# Altium project LimeSDR-QPCIe_1v2.PrjPcb (part 11 of 13)

## Sheet 27_BoardPowerSupply 1.SchDoc: Board power supply 1
size A3; Organization: Lime Microsystems; Address1: Surrey Tech Centre; Address2: Guildford GU2 7YG; Address3: Surrey; Address4: United Kingdom; Revision: v1.2; SheetNumber: 25; SheetTotal: 27
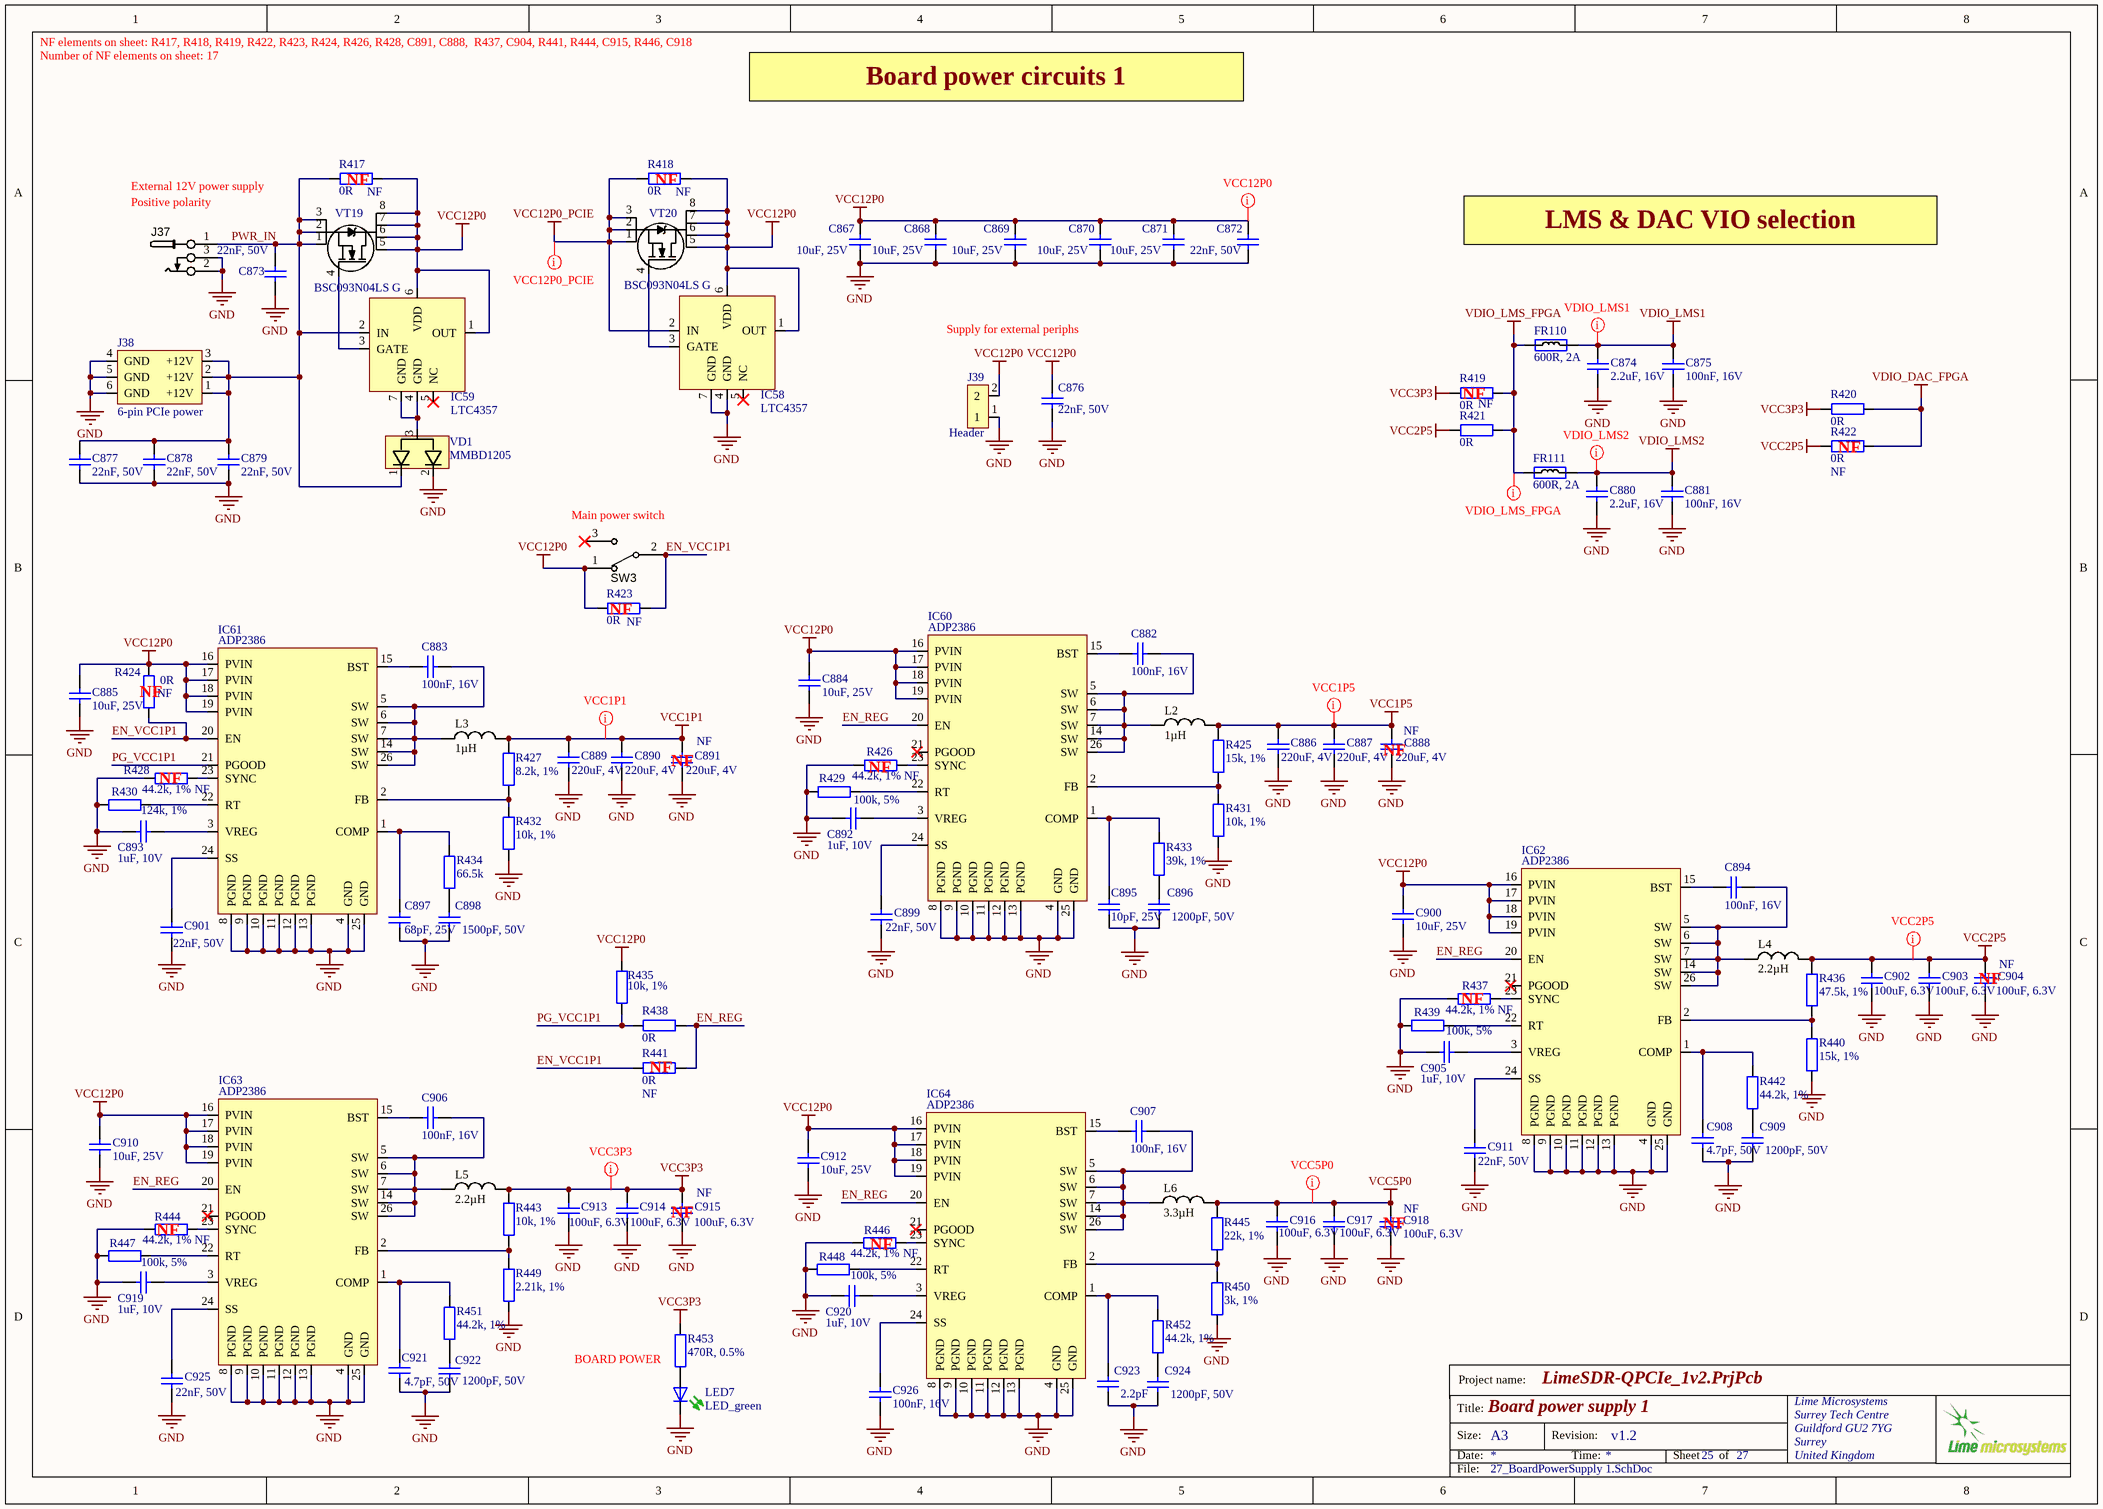
[diagram p26: 27_BoardPowerSupply 1.SchDoc]

### Parts
C867  10uF, 25V  [CAP0603]
C868  10uF, 25V  [CAP0603]
C869  10uF, 25V  [CAP0603]
C870  10uF, 25V  [CAP0603]
C871  10uF, 25V  [CAP0603]
C872  22nF, 50V  [CAP0402]
C873  22nF, 50V  [CAP0402]
C874  2.2uF, 16V  [CAP0402]
C875  100nF, 16V  [CAP0402]
C876  22nF, 50V  [CAP0402]
C877  22nF, 50V  [CAP0402]
C878  22nF, 50V  [CAP0402]
C879  22nF, 50V  [CAP0402]
C880  2.2uF, 16V  [CAP0402]
C881  100nF, 16V  [CAP0402]
C882  100nF, 16V  [CAP0402]
C883  100nF, 16V  [CAP0402]
C884  10uF, 25V  [CAP0805]
C885  10uF, 25V  [CAP0805]
C886  220uF, 4V  [CAP1206]
C887  220uF, 4V  [CAP1206]
C888  220uF, 4V  Assembly Info: NF  [CAP1206]
C889  220uF, 4V  [CAP1206]
C890  220uF, 4V  [CAP1206]
C891  220uF, 4V  Assembly Info: NF  [CAP1206]
C892  1uF, 10V  [CAP0402]
C893  1uF, 10V  [CAP0402]
C894  100nF, 16V  [CAP0402]
C895  10pF, 25V  [CAP0402]
C896  1200pF, 50V  [CAP0402]
C897  68pF, 25V  [CAP0402]
C898  1500pF, 50V  [CAP0402]
C899  22nF, 50V  [CAP0402]
C900  10uF, 25V  [CAP0805]
C901  22nF, 50V  [CAP0402]
C902  100uF, 6.3V  [CAP1206]
C903  100uF, 6.3V  [CAP1206]
C904  100uF, 6.3V  Assembly Info: NF  [CAP1206]
C905  1uF, 10V  [CAP0402]
C906  100nF, 16V  [CAP0402]
C907  100nF, 16V  [CAP0402]
C908  4.7pF, 50V  [CAP0402]
C909  1200pF, 50V  [CAP0402]
C910  10uF, 25V  [CAP0805]
C911  22nF, 50V  [CAP0402]
C912  10uF, 25V  [CAP0805]
C913  100uF, 6.3V  [CAP1206]
C914  100uF, 6.3V  [CAP1206]
C915  100uF, 6.3V  Assembly Info: NF  [CAP1206]
C916  100uF, 6.3V  [CAP1206]
C917  100uF, 6.3V  [CAP1206]
C918  100uF, 6.3V  Assembly Info: NF  [CAP1206]
C919  1uF, 10V  [CAP0402]
C920  1uF, 10V  [CAP0402]
C921  4.7pF, 50V  [CAP0402]
C922  1200pF, 50V  [CAP0402]
C923  2.2pF  [CAP0402]
C924  1200pF, 50V  [CAP0402]
C925  22nF, 50V  [CAP0402]
C926  100nF, 16V  [CAP0402]
FR110  600R, 2A  [RES0805]
FR111  600R, 2A  [RES0805]
IC58  LTC4357  [LTC4357]
IC59  LTC4357  [LTC4357]
IC60  ADP2386  [ADP2386]
IC61  ADP2386  [ADP2386]
IC62  ADP2386  [ADP2386]
IC63  ADP2386  [ADP2386]
IC64  ADP2386  [ADP2386]
J37  CONN_PWR_JACK_2.1x5.5mm  [CONN_PWR_JACK_v2]  (value not drawn)
J38  6-pin PCIe power  [PCIe_POWER_HEADER_6PIN]
J39  Header  [HDR_1x2]
L2  1µH  [FDVE1040_TOKO_INDUCTOR]
L3  1µH  [FDVE1040_TOKO_INDUCTOR]
L4  2.2µH  [FDVE1040_TOKO_INDUCTOR]
L5  2.2µH  [FDVE1040_TOKO_INDUCTOR]
L6  3.3µH  [FDVE1040_TOKO_INDUCTOR]
LED7  LED_green  [LED-0603-GREEN]
R417  0R  Assembly Info: NF  [RES0805]
R418  0R  Assembly Info: NF  [RES0805]
R419  0R  Assembly Info: NF  [RES0402]
R420  0R  [RES0402]
R421  0R  [RES0402]
R422  0R  Assembly Info: NF  [RES0402]
R423  0R  Assembly Info: NF  [RES0402]
R424  0R  Assembly Info: NF  [RES0402]
R425  15k, 1%  [RES0402]
R426  44.2k, 1%  Assembly Info: NF  [RES0402]
R427  8.2k, 1%  [RES0402]
R428  44.2k, 1%  Assembly Info: NF  [RES0402]
R429  100k, 5%  [RES0402]
R430  124k, 1%  [RES0402]
R431  10k, 1%  [RES0402]
R432  10k, 1%  [RES0402]
R433  39k, 1%  [RES0402]
R434  66.5k  [RES0402]
R435  10k, 1%  [RES0402]
R436  47.5k, 1%  [RES0402]
R437  44.2k, 1%  Assembly Info: NF  [RES0402]
R438  0R  [RES0402]
R439  100k, 5%  [RES0402]
R440  15k, 1%  [RES0402]
R441  0R  Assembly Info: NF  [RES0402]
R442  44.2k, 1%  [RES0402]
R443  10k, 1%  [RES0402]
R444  44.2k, 1%  Assembly Info: NF  [RES0402]
R445  22k, 1%  [RES0402]
R446  44.2k, 1%  Assembly Info: NF  [RES0402]
R447  100k, 5%  [RES0402]
R448  100k, 5%  [RES0402]
R449  2.21k, 1%  [RES0402]
R450  3k, 1%  [RES0402]
R451  44.2k, 1%  [RES0402]
R452  44.2k, 1%  [RES0402]
R453  470R, 0.5%  [RES0402]
SW3  ON-ON  [SWITCH_SPDT_SLIDER_v2]  (value not drawn)
VD1  MMBD1205  [SOT23-3_v2]
VT19  BSC093N04LS G  [BSC093N04LS_G]
VT20  BSC093N04LS G  [BSC093N04LS_G]

### Nets
GND: C867.1 C868.1 C869.1 C870.1 C871.1 C872.2 C873.2 C874.1 C875.2 C876.2 C877.2 C878.2 C879.2 C880.1 C881.2 C884.1 C885.1 C886.1 C887.1 C888.1 C889.1 C890.1 C891.1 C892.2 C893.2 C895.2 C896.2 C897.2 C898.2 C899.2 C900.1 C901.2 C902.1 C903.1 C904.1 C905.2 C908.2 C909.2 C910.1 C911.2 C912.1 C913.1 C914.1 C915.1 C916.1 C917.1 C918.1 C919.2 C920.2 C921.2 C922.2 C923.2 C924.2 C925.2 C926.1 IC58.4(GND) IC58.7(GND) IC60.4(GND) IC60.8(PGND) IC60.9(PGND) IC60.10(PGND) IC60.11(PGND) IC60.12(PGND) IC60.13(PGND) IC60.25(GND) IC61.4(GND) IC61.8(PGND) IC61.9(PGND) IC61.10(PGND) IC61.11(PGND) IC61.12(PGND) IC61.13(PGND) IC61.25(GND) IC62.4(GND) IC62.8(PGND) IC62.9(PGND) IC62.10(PGND) IC62.11(PGND) IC62.12(PGND) IC62.13(PGND) IC62.25(GND) IC63.4(GND) IC63.8(PGND) IC63.9(PGND) IC63.10(PGND) IC63.11(PGND) IC63.12(PGND) IC63.13(PGND) IC63.25(GND) IC64.4(GND) IC64.8(PGND) IC64.9(PGND) IC64.10(PGND) IC64.11(PGND) IC64.12(PGND) IC64.13(PGND) IC64.25(GND) J37.2 J37.3 J38.4(GND) J38.5(GND) J38.6(GND) J39.1 LED7.K(C) R426.2 R428.2 R429.2 R430.2 R431.2 R432.2 R437.2 R439.2 R440.1 R444.2 R446.2 R447.2 R448.2 R449.1 R450.1 VD1.2
VCC1P1: C889.2 C890.2 C891.2 L3.2 R427.2
VCC1P5: C886.2 C887.2 C888.2 L2.2 R425.2
VCC2P5: C902.2 C903.2 C904.2 L4.2 R421.2 R422.2 R436.2
VCC3P3: C913.2 C914.2 C915.2 L5.2 R419.2 R420.2 R443.1 R453.2
VCC5P0: C916.2 C917.2 C918.2 L6.2 R445.2
VCC12P0: C867.2 C868.2 C869.2 C870.2 C871.2 C872.1 C876.1 C884.2 C885.2 C900.2 C910.2 C912.2 IC58.1(OUT) IC58.6(VDD) IC59.1(OUT) IC59.6(VDD) IC60.16(PVIN) IC60.17(PVIN) IC60.18(PVIN) IC60.19(PVIN) IC61.16(PVIN) IC61.17(PVIN) IC61.18(PVIN) IC61.19(PVIN) IC62.16(PVIN) IC62.17(PVIN) IC62.18(PVIN) IC62.19(PVIN) IC63.16(PVIN) IC63.17(PVIN) IC63.18(PVIN) IC63.19(PVIN) IC64.16(PVIN) IC64.17(PVIN) IC64.18(PVIN) IC64.19(PVIN) J39.2 R417.1 R418.1 R423.1 R424.2 R435.1 SW3.1 VT19.5(D) VT19.6(D) VT19.7(D) VT19.8(D) VT20.5(D) VT20.6(D) VT20.7(D) VT20.8(D)
VCC12P0_PCIE: IC58.2(IN) R418.2 VT20.1(S) VT20.2(S) VT20.3(S)
VDIO_DAC_FPGA: R420.1 R422.1
VDIO_LMS1: C874.2 C875.1 FR110.2
VDIO_LMS2: C880.2 C881.1 FR111.2
VDIO_LMS_FPGA: FR110.1 FR111.1 R419.1 R421.1
EN_REG: IC60.20(EN) IC62.20(EN) IC63.20(EN) IC64.20(EN) R438.2 R441.2
EN_VCC1P1: IC61.20(EN) R423.2 R424.1 R441.1 SW3.2
PG_VCC1P1: IC61.21(PGOOD) R435.2 R438.1
PWR_IN: C873.1 C877.1 C878.1 C879.1 IC59.2(IN) J37.1 J38.1(+12V) J38.2(+12V) J38.3(+12V) R417.2 VD1.1 VT19.1(S) VT19.2(S) VT19.3(S)
NetC882_1: C882.1 IC60.15(BST)
NetC882_2: C882.2 IC60.5(SW) IC60.6(SW) IC60.7(SW) IC60.14(SW) IC60.26(SW) L2.1
NetC883_1: C883.1 IC61.15(BST)
NetC883_2: C883.2 IC61.5(SW) IC61.6(SW) IC61.7(SW) IC61.14(SW) IC61.26(SW) L3.1
NetC892_1: C892.1 IC60.3(VREG)
NetC893_1: C893.1 IC61.3(VREG)
NetC894_1: C894.1 IC62.15(BST)
NetC894_2: C894.2 IC62.5(SW) IC62.6(SW) IC62.7(SW) IC62.14(SW) IC62.26(SW) L4.1
NetC895_1: C895.1 IC60.1(COMP) R433.2
NetC896_1: C896.1 R433.1
NetC897_1: C897.1 IC61.1(COMP) R434.2
NetC898_1: C898.1 R434.1
NetC899_1: C899.1 IC60.24(SS)
NetC901_1: C901.1 IC61.24(SS)
NetC905_1: C905.1 IC62.3(VREG)
NetC906_1: C906.1 IC63.15(BST)
NetC906_2: C906.2 IC63.5(SW) IC63.6(SW) IC63.7(SW) IC63.14(SW) IC63.26(SW) L5.1
NetC907_1: C907.1 IC64.15(BST)
NetC907_2: C907.2 IC64.5(SW) IC64.6(SW) IC64.7(SW) IC64.14(SW) IC64.26(SW) L6.1
NetC908_1: C908.1 IC62.1(COMP) R442.2
NetC909_1: C909.1 R442.1
NetC911_1: C911.1 IC62.24(SS)
NetC919_1: C919.1 IC63.3(VREG)
NetC920_1: C920.1 IC64.3(VREG)
NetC921_1: C921.1 IC63.1(COMP) R451.2
NetC922_1: C922.1 R451.1
NetC923_1: C923.1 IC64.1(COMP) R452.2
NetC924_1: C924.1 R452.1
NetC925_1: C925.1 IC63.24(SS)
NetC926_2: C926.2 IC64.24(SS)
NetIC58_3: IC58.3(GATE) VT20.4(G)
NetIC59_3: IC59.3(GATE) VT19.4(G)
NetIC59_4: IC59.4(GND) IC59.7(GND) VD1.3
NetIC60_2: IC60.2(FB) R425.1 R431.1
NetIC60_22: IC60.22(RT) R429.1
NetIC60_23: IC60.23(SYNC) R426.1
NetIC61_2: IC61.2(FB) R427.1 R432.1
NetIC61_22: IC61.22(RT) R430.1
NetIC61_23: IC61.23(SYNC) R428.1
NetIC62_2: IC62.2(FB) R436.1 R440.2
NetIC62_22: IC62.22(RT) R439.1
NetIC62_23: IC62.23(SYNC) R437.1
NetIC63_2: IC63.2(FB) R443.2 R449.2
NetIC63_22: IC63.22(RT) R447.1
NetIC63_23: IC63.23(SYNC) R444.1
NetIC64_2: IC64.2(FB) R445.1 R450.2
NetIC64_22: IC64.22(RT) R448.1
NetIC64_23: IC64.23(SYNC) R446.1
NetLED7_A: LED7.A R453.1

Not connected (* = marked no-connect by the designer): IC58 5(NC)*; IC59 5(NC)*; IC60 21(PGOOD)*; IC62 21(PGOOD)*; IC63 21(PGOOD)*; IC64 21(PGOOD)*; SW3 3*

### Layout directives
net class VCC12P0: VCC12P0
net class VCC12P0_PCIE: VCC12P0_PCIE
net class VCC1P1: VCC1P1
net class VCC1P5: VCC1P5
net class VCC2P5: VCC2P5
net class VCC5P0: VCC5P0
net class VCC3P3: VCC3P3
net class VDIO_LMS1: VDIO_LMS1
net class VDIO_LMS_FPGA: VDIO_LMS_FPGA
net class VDIO_LMS2: VDIO_LMS2

### Notes on the sheet
- NF elements on sheet: R417, R418, R419, R422, R423, R424, R426, R428, C891, C888,  R437, C904, R441, R444, C915, R446, C918
- Number of NF elements on sheet: 17
- Board power circuits 1
- (near J37) Positive polarity
- External 12V power supply
- (near R417) NF
- (near R418) NF
- LMS & DAC VIO selection
- Supply for external periphs
- (near R419) NF
- (near R422) NF
- (near SW3) Main power switch
- (near R423) NF
- (near R424) NF
- (near R428) NF
- (near C891) NF
- (near R426) NF
- (near C888) NF
- (near C904) NF
- (near R437) NF
- (near R441) NF
- (near R444) NF
- (near C915) NF
- (near R446) NF
- (near C918) NF
- BOARD POWER
- Project name:
- Title:
- Size:
- Date:
- A3
- Revision:
- Time:
- Sheet
- of
- File:

### Library data of the parts
C867-C871 = Cap_0603: Manufacturer: Murata Electronics North America; Manufacturer Part Number 1: GRM188R61E106MA73D; Part Description: 10µF ±20% 25V Ceramic Capacitor X5R 0603 (1608 Metric); Capacitance: 10µF; Tolerance: ±20%; Temperature Coefficient: X5R; Supplier 1: Digi-Key; Supplier Part Number 1: 490-7202-2-ND; Category: Capacitors; RoHS: RoHS Compliant; Packaging: Tape & Reel (TR); Voltage - Rated: 25V; Mounting Type: Surface Mount, MLCC; Operating Temperature: -55°C ~ 85°C; Applications: General Purpose; Ratings: -; Package / Case: 0603 (1608 Metric); Size / Dimension: 0.063" L x 0.031" W (1.60mm x 0.80mm); Height - Seated (Max): -; Thickness (Max): 0.031" (0.80mm); Lead Spacing: -; Features: -; Lead Style: -; value: 10uF, 25V
C872 C873 C876-C879 C899 C901 C911 C925 = Cap_0402: Manufacturer: Kemet; Manufacturer Part Number 1: C0402C223K5RACTU; Part Description: 0.022µF ±10% 50V Ceramic Capacitor X7R 0402 (1005 Metric); Temperature Coefficient: X7R; Tolerance: ±10%; Capacitance: 0.022µF; Value: 22nF, 50V; Supplier 1: Digi-Key; Supplier Part Number 1: 399-7780-1-ND; Ratings: -; Packaging: Cut Tape (CT); Category: Capacitors; Size / Dimension: 0.039" L x 0.020" W (1.00mm x 0.50mm); RoHS: RoHS Compliant; Operating Temperature: -55°C ~ 125°C; Mounting Type: Surface Mount, MLCC; Applications: General Purpose; Voltage - Rated: 50V; Thickness (Max): 0.022" (0.55mm); Features: -; Height - Seated (Max): -; Lead Style: -; Package / Case: 0402 (1005 Metric); Lead Spacing: -
C874 C880 = Cap_0402: CAP CER 2.2UF 16V 10% X5R 0402; Manufacturer Part Number 1: C1005X5R1C225K050BC; Manufacturer: TDK Corporation; Part Description: 2.2µF ±10% 16V Ceramic Capacitor X5R 0402 (1005 Metric); Capacitance: 2.2µF; Tolerance: ±20%; Capacitor Case Style: 0402 [1005 Metric]; Value: 2.2uF, 16V; Supplier 1: Digi-Key; Supplier Part Number 1: 445-9085-6-ND; Category: Capacitors; Voltage - Rated: 16V; Thickness (Max): 0.022" (0.55mm); Applications: General Purpose; Package / Case: 0402 (1005 Metric); Size / Dimension: 0.039" L x 0.020" W (1.00mm x 0.50mm); Features: -; Temperature Coefficient: X5R; Mounting Type: Surface Mount, MLCC; Ratings: -; Lead Style: -; Operating Temperature: -55°C ~ 85°C; Lead Spacing: -; RoHS: RoHS Compliant; Height - Seated (Max): -; Packaging: Tape & Reel (TR); Operating Temperature Range: -55°C to +85
C875 C881 C926 = Cap_0402: Manufacturer: Murata Electronics; Manufacturer Part Number: GRM155R71C104KA88D; Part Description: 0.10µF ±10% 16V Ceramic Capacitor X7R 0402 (1005 Metric); Tolerance: 10 %; Type: General Purpose MLCC; Capacitance: 0.1 uF; Case Length: 1 mm; Dielectric: X7R; Case Height: 0.5 mm; Temperature Coefficient / Code: +/- 15 %; Value: 100nF, 16V; Supplier 1: Mouser; Supplier Part Number 1: 81-GRM155R71C104KA88; Case Code - in: 0402; RoHS: RoHS Compliant; Operating Temperature Range: - 55 C to + 125 C; Series: GRM; Termination Style: SMD/SMT; Package / Case: 0402 (1005 metric); Voltage Rating DC: 16 V; Maximum Operating Temperature: + 125 C; Case Code - mm: 1005; Minimum Operating Temperature: - 55 C; Product Category: Low & Medium Capacitance SMD Ceramic Chip Capacitors; Packaging: Reel; Product: General Type MLCCs; Category: Multilayer Ceramic Capacitors MLCC - SMD/SMT; Brand: Murata Electronics; Case Width: 0.5 mm; RoHS - Mouser: Y; Standard Pack Qty: 10000; Minimum Order Quantity: 1; Reeling: True; Manufacturer Part Number 1: GRM155R71C104KA88D
C882 C883 C894 C906 C907 = Cap_0402: Manufacturer: Murata Electronics; Manufacturer Part Number 1: GRM155R71C104KA88D; Part Description: 0.10µF ±10% 16V Ceramic Capacitor X7R 0402 (1005 Metric); Tolerance: 10 %; Type: General Purpose MLCC; Capacitance: 0.1 uF; Case Length: 1 mm; Dielectric: X7R; Case Height: 0.5 mm; Temperature Coefficient / Code: +/- 15 %; Value: 100nF, 16V; Supplier 1: Mouser; Supplier Part Number 1: 81-GRM155R71C104KA88; Case Code - in: 0402; RoHS: RoHS Compliant; Operating Temperature Range: - 55 C to + 125 C; Series: GRM; Termination Style: SMD/SMT; Package / Case: 0402 (1005 metric); Voltage Rating DC: 16 V; Maximum Operating Temperature: + 125 C; Case Code - mm: 1005; Minimum Operating Temperature: - 55 C; Product Category: Low & Medium Capacitance SMD Ceramic Chip Capacitors; Packaging: Reel; Product: General Type MLCCs; Category: Multilayer Ceramic Capacitors MLCC - SMD/SMT; Brand: Murata Electronics; Case Width: 0.5 mm; RoHS - Mouser: Y; Standard Pack Qty: 10000; Minimum Order Quantity: 1; Reeling: True; Manufacturer Part Number: GRM155R71C104KA88D
C884 C885 C900 C910 C912 = Cap_0805: Manufacturer: Murata Electronics North America; Manufacturer Part Number 1: GRM188R61E106MA73D; Part Description: 10µF ±20% 25V Ceramic Capacitor X5R 0603 (1608 Metric); Tolerance: ±10%; Temperature Coefficient: X5R; Capacitance: 10µF; Value: 10uF, 25V; Supplier 1: Digi-Key; Supplier Part Number 1: 490-7207-1-ND; Ratings: -; Voltage - Rated: 25V; RoHS: RoHS Compliant; Lead Spacing: -; Lead Style: -; Size / Dimension: 0.079" L x 0.049" W (2.01mm x 1.25mm); Mounting Type: Surface Mount, MLCC; Category: Capacitors; Features: -; Applications: General Purpose; Thickness (Max): 0.037" (0.95mm); Package / Case: 0603 (1608 Metric); Operating Temperature: -55°C ~ 85°C; Packaging: Tape & Reel (TR); Height - Seated (Max): -
C886-C891 = Cap_1206: Manufacturer Part Number: GRM31CR60G227ME11L; Manufacturer: Murata Electronics North America; Part Description: 220µF ±20% 4V Ceramic Capacitor X5R 1206 (3216 Metric); Capacitance: 220µF; Temperature Coefficient: X5R; Tolerance: ±20%; Package / Case: 1206 (3216 Metric); Supplier 1: Digi-Key; Packaging: Cut Tape (CT); Size / Dimension: 0.126" L x 0.063" W (3.20mm x 1.60mm); Operating Temperature: -55°C ~ 85°C; Voltage - Rated: 4V; Mounting Type: Surface Mount, MLCC; Ratings: -; Supplier Part Number 1: 490-9774-1-ND; Category: Capacitors; Lead Spacing: -; Lead Style: -; Applications: General Purpose; Features: -; Height - Seated (Max): -; Thickness (Max): 0.075" (1.90mm); RoHS: RoHS Compliant; Value: 220uF, 4V
C892 C893 C905 C919 C920 = Cap_0402: Manufacturer Part Number 1: GRM155R61A105KE15J; Manufacturer: TDK; Part Description: 1µF ±10% 10V Ceramic Capacitor X5R 0402 (1005 Metric); Voltage Rating: 10; Capacitance Tolerance: ± 10%; Product Range: TDK - C Series; Ceramic Capacitor Case: 0402 [1005 Metric]; Capacitance: 1; Dielectric Characteristic: X6; Value: 1uF, 10V; Supplier 1: Newark; Supplier Part Number 1: 490-6298-2-ND; MSL: -; RoHS: YES
C895 = Cap_0402: Manufacturer Part Number 1: 04023A100JAT2A; Manufacturer: AVX; Part Description: 10pF ±5% 25V Ceramic Capacitor C0G, NP0 0402 (1005 Metric); Capacitance Tolerance: ± 5%; Voltage Rating: 25; Ceramic Capacitor Case: 0402 [1005 Metric]; Capacitor Case Style: 0402 [1005 Metric]<!--FANDB--><div class="features-and-benefits-container"></div>; Dielectric Characteristic: C0G / NP0; SVHC: No SVHC (16-Jun-2014); Capacitance: 10; Value: 10pF, 25V; Supplier 1: Farnell; Supplier Part Number 1: 2332478RL; Product Range: -; RoHS: YES; Operating Temperature Min: -55; Operating Temperature Max: 125; Capacitance Tolerance ±: ± 5%; MSL: MSL 1 - Unlimited; Packaging: Cut Tape
C896 C909 C922 C924 = Cap_0402: Manufacturer: Kemet; Manufacturer Part Number 1: C0402C122J5GACTU; Part Description: 1200pF ±5% 50V Ceramic Capacitor C0G, NP0 0402 (1005 Metric); Temperature Coefficient: C0G, NP0; Tolerance: ±5%; Value: 1200pF, 50V; Supplier 1: Digi-Key; Supplier Part Number 1: 399-7334-1-ND; Thickness (Max): 0.022" (0.55mm); Capacitance: 1200pF; Lead Spacing: -; Mounting Type: Surface Mount, MLCC; Package / Case: 0402 (1005 Metric); Category: Capacitors; Size / Dimension: 0.039" L x 0.020" W (1.00mm x 0.50mm); Voltage - Rated: 50V; Lead Style: -; Ratings: -; Features: -; Packaging: Cut Tape (CT); RoHS: RoHS Compliant; Operating Temperature: -55°C ~ 125°C; Applications: General Purpose; Height - Seated (Max): -
C897 = Cap_0402: Manufacturer Part Number 1: CBR04C680F3GAC; Manufacturer: Kemet; Part Description: 68pF ±1% 25V Ceramic Capacitor C0G, NP0 0402 (1005 Metric); Temperature Coefficient: C0G, NP0; Tolerance: ±1%; Value: 68pF, 25V; Supplier 1: Digi-Key; Supplier Part Number 1: 399-11255-1-ND; Applications: RF, Microwave, High Frequency; Voltage - Rated: 25V; Capacitance: 68pF; Mounting Type: Surface Mount, MLCC; Package / Case: 0402 (1005 Metric); Features: High Q, Low Loss; Lead Spacing: -; Size / Dimension: 0.039" L x 0.020" W (1.00mm x 0.50mm); Operating Temperature: -55°C ~ 125°C; Packaging: Cut Tape (CT); Thickness (Max): 0.022" (0.55mm); Category: Capacitors; Lead Style: -; Ratings: -; Height - Seated (Max): -; RoHS: RoHS Compliant
C898 = Cap_0402: Manufacturer Part Number 1: CL05B152KB5NNNC; Manufacturer: Samsung Electro-Mechanics America, Inc.; Part Description: 1500pF ±10% 50V Ceramic Capacitor X7R 0402 (1005 Metric); Temperature Coefficient: X7R; Tolerance: ±10%; Value: 1500pF, 50V; Supplier 1: Digi-Key; Supplier Part Number 1: 1276-1521-1-ND; Thickness (Max): 0.022" (0.55mm); Features: -; Category: Capacitors; Size / Dimension: 0.039" L x 0.020" W (1.00mm x 0.50mm); RoHS: RoHS Compliant; Package / Case: 0402 (1005 Metric); Mounting Type: Surface Mount, MLCC; Packaging: Cut Tape (CT); Lead Style: -; Lead Spacing: -; Capacitance: 1500pF; Voltage - Rated: 50V; Applications: General Purpose; Height - Seated (Max): -; Ratings: -; Operating Temperature: -55°C ~ 125°C
C902-C904 C913-C918 = Cap_1206: Manufacturer: MURATA; Manufacturer Part Number 1: GRM31CR60J107ME39L.; Part Description: SMD Multilayer Ceramic Capacitor, 1206 [3216 Metric], 100 µF, 6.3 V, ± 20%, X5R, GRM Series; Capacitance Tolerance: ± 20%; Ceramic Capacitor Case: 1206 [3216 Metric]; Voltage Rating: 6.3; value: 100uF, 6.3V; Supplier Part Number 1: 1735535; Supplier 1: Farnell
C908 C921 = Cap_0402: Manufacturer: MURATA; Manufacturer Part Number 1: GRM1555C1H4R7CA01D; Part Description: 4.7pF ±0.25pF 50V Ceramic Capacitor C0G, NP0 0402 (1005 Metric); Capacitance Tolerance: ± 0.25; Voltage Rating: 50; Dielectric Characteristic: C0G / NP0; Ceramic Capacitor Case: 0402 [1005 Metric]; Capacitance: 4.7; SVHC: No SVHC (15-Jun-2015; Product Range: GRM Series; Value: 4.7pF, 50V; Supplier 1: Farnell; Supplier Part Number 1: 2434644; Operating Temperature Max: 125; Operating Temperature Min: -55; MSL: MSL 1 - Unlimited; RoHS: YES; Packaging: Cut Tape
C923 = Cap_0402: Manufacturer Part Number 1: CL05C2R2CB5NNNC; Manufacturer: Samsung Electro-Mechanics America, Inc.; Part Description: 2.2pF ±0.25pF 50V Ceramic Capacitor C0G, NP0 0402 (1005 Metric); Voltage - Rated: 50V; Temperature Coefficient: C0G, NP0; Tolerance: ±0.25pF; Value: 2.2pF; Lead Spacing: -; Applications: General Purpose; Supplier 1: Digi-Key; Thickness (Max): 0.022" (0.55mm); Operating Temperature: -55°C ~ 125°C; Size / Dimension: 0.039" L x 0.020" W (1.00mm x 0.50mm); Mounting Type: Surface Mount, MLCC; Features: -; Capacitance: 2.2pF; Lead Style: -; Supplier Part Number 1: 1276-1271-1-ND; Height - Seated (Max): -; Package / Case: 0402 (1005 Metric); Category: Capacitors; Packaging: Cut Tape (CT); Ratings: -; RoHS: RoHS Compliant
FR110 FR111 = Ferrite: Manufacturer Part Number 1: MPZ2012S601A; Manufacturer: TDK; Part Description: FERRITE BEAD 600 OHM 0805 1LN; Filter Type: Differential Mode - Single; Impedance @ Frequency: 600 Ohm @ 100MHz; DC Resistance (DCR): 100 mOhm Max; DC Current Rating: 2; DC Resistance Max: 0.1; Ferrite Case Style: 0805 [2012 Metric]; Ferrite Mounting: SMD; Impedance @ 100MHz: 600; Impedance Tolerance: ± 25%; Supplier 1: Farnell; Supplier Part Number 1: 1669753RL; Mounting Type: Surface Mount; RoHS: RoHS Compliant; Height (Max): 0.041" (1.05mm); Packaging: Tape & Reel (TR); Category: Filters; Current Rating: 2A; Package / Case: 0805 (2012 Metric); Size / Dimension: 0.079" L x 0.049" W (2.00mm x 1.25mm); Value: 600R, 2A; Core Material: Ferrite; Supplier: Farnell
IC58 IC59 = LTC4357: Manufacturer Part Number 1: LTC4357IDCB#TRMPBF; Part Description: OR Controller N+1 ORing Controller N-Channel N:1 6-DFN (2x3); Current - Supply: 500µA; Delay Time - OFF: 300ns; Voltage - Supply: 9 V ~ 80 V; FET Type: N-Channel; Supplier 1: Digi-Key; Type: N+1 ORing Controller; Category: Integrated Circuits (ICs); Applications: Automotive, Redundant Power Supplies, Telecom Infrastructure; Operating Temperature: -40°C ~ 85°C; Supplier Device Package: 6-DFN (2x3); Supplier Part Number 1: LTC4357IDCB#TRMPBFDKR-ND
IC60-IC64 = ADP2386: Manufacturer: Analog Devices Inc.; Part Description: Buck Switching Regulator IC Positive Adjustable 0.6V 1 Output 6A 24-WFQFN Exposed Pad, CSP; Manufacturer Part Number 1: ADP2386ACPZN-R7; Function: Step-Down; Voltage - Output (Max): 18V; Synchronous Rectifier: Yes; Output Configuration: Positive; Frequency - Switching: 200kHz ~ 1.4MHz; Number of Outputs: 1; Output Type: Adjustable; Topology: Buck; Voltage - Input (Min): 4.5V; Voltage - Output (Min/Fixed): 0.6V; Voltage - Input (Max): 20V; Current - Output: 6A; Supplier 1: Digi-Key; Packaging: Digi-Reel®; RoHS: RoHS Compliant; Package / Case: 24-WFQFN Exposed Pad, CSP; Operating Temperature: -40°C ~ 125°C (TJ); Supplier Device Package: 24-LFCSP-WQ (4x4); Mounting Type: Surface Mount; Category: Integrated Circuits (ICs); Supplier Part Number 1: ADP2386ACPZN-R7DKR-ND
J37 = CONN_PWR_JACK_2.1x5.5mm: Power Connector, THT, 2.1mm ID, 5.5mm OD; Manufacturer Part Number 1: RAPC712X; Manufacturer: SWITCHCRAFT; Part Description: Power Barrel Connector Jack 2.50mm ID (0.098"), 5.50mm OD (0.217") Through Hole, Right Angle; Contact Termination Type: Solder; Connector Mounting: PCB; Current Rating: 5; Gender: Receptacle; Voltage Rating V AC: 250; Supplier 1: Farnell; Supplier Part Number 1: 1608726; Mounting Type: PCB Through Hole; Contact Termination: Solder
J38 = PCIe_PWR_HEADER_6PIN: Manufacturer Part Number 1: 0455580003; Manufacturer: Molex Connector Corporation; Part Description: 6 Positions Header, Shrouded Connector 0.165" (4.20mm) Through Hole, Right Angle Tin; Number of Positions Loaded: All; Pitch: 0.165" (4.20mm); Number of Positions: 6; Connector Type: Header, Shrouded; Supplier 1: Digi-Key; Contact Finish: Tin; Contact Finish Thickness: 100µin (2.54µm); Fastening Type: Locking Ramp; RoHS: RoHS Compliant; Contact Type: Male Pin; Features: Board Lock; Color: Black; Packaging: Tray; Mounting Type: Through Hole, Right Angle; Category: Connectors, Interconnects; Contact Mating Length: -; Row Spacing: 0.165" (4.20mm); Termination: Solder; Number of Rows: 2; Supplier Part Number 1: WM10869-ND
J39 = Jumper: Manufacturer Part Number 1: 961102-6404-AR; Part Description: 2 Positions Header, Unshrouded Connector 0.100" (2.54mm) Through Hole Gold; Manufacturer: 3M; Connector Type: Header, Unshrouded; Supplier 1: Digi-Key; Supplier Part Number 1: 3M9447-ND; Contact Type: Male Pin; Color: Black; Mounting Type: Through Hole; Category: Connectors, Interconnects; Contact Finish: Gold
L2 L3 = Inductor_0603: Manufacturer: Vishay Dale; Manufacturer Part Number 1: IHLP3232DZER1R0M01; Part Description: 1µH Shielded Molded Inductor 18A 5.78 mOhm Max Nonstandard; Tolerance: ±20%; Frequency - Test: 100kHz; DC Resistance (DCR): 5.78 mOhm Max; Frequency - Self Resonant: 42MHz; Shielding: Shielded; Current - Saturation: 24A; Current Rating: 18A; Type: Molded; value: 1µH; Supplier 1: Digi-Key; Supplier Part Number 1: 541-1371-6-ND; Supplier Device Package: -; Packaging: Digi-Reel®; Inductance: 1µH; Height - Seated (Max): 0.158" (4.00mm); RoHS: RoHS Compliant; Size / Dimension: 0.340" L x 0.322" W (8.64mm x 8.18mm); Category: Inductors, Coils, Chokes; Mounting Type: Surface Mount; Material - Core: -; Package / Case: Nonstandard; Q @ Freq: -; Operating Temperature: -55°C ~ 125°C
L4 L5 = Inductor_0603: Manufacturer Part Number 1: IHLP4040DZER2R2M01; Manufacturer: Vishay Dale; Part Description: 2.2µH Shielded Molded Inductor 12A 9 mOhm Max Nonstandard; Type: Molded; Current Rating: 12A; Frequency - Test: 100kHz; Current - Saturation: 25.6A; DC Resistance (DCR): 9 mOhm Max; Shielding: Shielded; Tolerance: ±20%; Supplier 1: Digi-Key; Supplier Part Number 1: 541-1299-1-ND; Package / Case: Nonstandard; Material - Core: -; Size / Dimension: 0.430" L x 0.405" W (10.92mm x 10.30mm); Supplier Device Package: -; Inductance: 2.2µH; Frequency - Self Resonant: -; Packaging: Cut Tape (CT); Height - Seated (Max): 0.158" (4.00mm); Category: Inductors, Coils, Chokes; RoHS: RoHS Compliant; Mounting Type: Surface Mount; Operating Temperature: -55°C ~ 125°C; Q @ Freq: -; value: 2.2µH
L6 = Inductor_0603: Manufacturer: Vishay Dale; Manufacturer Part Number: IHLP4040DZER3R3M01; Part Description: 3.3µH Shielded Molded Inductor 10A 14.4 mOhm Max Nonstandard; DC Resistance (DCR): 14.4 mOhm Max; Shielding: Shielded; Type: Molded; Current Rating: 10A; Frequency - Test: 100kHz; Current - Saturation: 18.6A; Tolerance: ±20%; value: 3.3µH; Package / Case: Nonstandard; Q @ Freq: -; Supplier 1: Digi-Key; Packaging: Cut Tape (CT); Inductance: 3.3µH; Material - Core: -; Category: Inductors, Coils, Chokes; Frequency - Self Resonant: -; Height - Seated (Max): 0.158" (4.00mm); Supplier Device Package: -; RoHS: RoHS Compliant; Size / Dimension: 0.430" L x 0.405" W (10.92mm x 10.30mm); Mounting Type: Surface Mount; Operating Temperature: -55°C ~ 125°C; Supplier Part Number 1: 541-1298-1-ND
LED7 = LED_green: Manufacturer Part Number 1: HSMG-C190; Manufacturer: Avago Technologies US Inc.; Part Description: Green 572nm LED Indication - Discrete 2.2V 0603 (1608 Metric); Manufacturer: Broadcom Limited; Color: Green; Wavelength - Peak: 570nm; Viewing Angle: 170°; Lens Type: Diffused; Lens Style/Size: Rectangle with Flat Top, 1mm x 0.8mm; Voltage - Forward (Vf) (Typ): 2.2V; Millicandela Rating: 15mcd; Current - Test: 20mA; Wavelength - Dominant: 572nm; Supplier 1: Digi-Key; Supplier Part Number 1: 516-1425-2-ND; Height: 0.80mm; Size / Dimension: 1.60mm L x 0.80mm W; Mounting Type: Surface Mount; Category: Optoelectronics; RoHS: RoHS Compliant; Luminous Flux @ Current - Test: -; Package / Case: 0603 (1608 Metric); Packaging: Tape & Reel (TR)
R417 R418 = Res_0402: Manufacturer Part Number 1: CRCW08050000Z0EA; Manufacturer: Vishay Dale; Part Description: RES SMD 0.0 OHM JUMPER 1/8W 0805; Power (Watts): 0.125W, 1/8W; Resistance (Ohms): 0.0; Tolerance: Jumper; Value: 0R; Supplier 1: Digi-Key; Supplier Part Number 1: 541-0.0ATR-ND; Package / Case: 0805 (2012 Metric); Height: 0.020" (0.50mm); Packaging: Tape & Reel (TR); Operating Temperature: -55°C ~ 155°C; Temperature Coefficient: -; RoHS: RoHS Compliant; Size / Dimension: 0.079" L x 0.049" W (2.00mm x 1.25mm); Supplier Device Package: 0805 (2012 Metric); Number of Terminations: 2; Category: Resistors; Features: Automotive AEC-Q200; Composition: Thick Film
R419-R423 R438 R441 = Res_0402: Manufacturer Part Number 1: RC0402JR-070RL; Manufacturer: Yageo; Part Description: RES SMD 0.0OHM JUMPER 1/16W 0402; Resistance (Ohms): 0.0; Tolerance: Jumper; Power (Watts): 0.063W, 1/16W; Value: 0R; Supplier 1: Digi-Key; Supplier Part Number 1: 311-0.0JRTR-ND; Category: Resistors; Temperature Coefficient: -; Features: Moisture Resistant; Supplier Device Package: 0402; Height: 0.016" (0.40mm); Package / Case: 0402 (1005 Metric); Operating Temperature: -55°C ~ 155°C; Size / Dimension: 0.039" L x 0.020" W (1.00mm x 0.50mm); Composition: Thick Film; Packaging: Tape & Reel (TR); Number of Terminations: 2; RoHS: RoHS Compliant
R424 = Res_0402: Manufacturer: Yageo; Part Description: RES SMD 0.0OHM JUMPER 1/16W 0402; Manufacturer Part Number 1: RC0402JR-070RL; Supplier 1: Digi-Key; Supplier Part Number 1: 311-0.0JRTR-ND; Composition: Thick Film; Package / Case: 0402 (1005 Metric); Category: Resistors; Value: 0R
R425 R440 = Res_0402: Manufacturer: Yageo; Manufacturer Part Number 1: RC0402FR-0715KL; Part Description: RES SMD 15K OHM 1% 1/16W 0402; Temperature Coefficient: ±100ppm/°C; Power (Watts): 0.063W, 1/16W; Value: 15k, 1%; Category: Resistors; Number of Terminations: 2; RoHS: RoHS Compliant; Features: Moisture Resistant; Operating Temperature: -55°C ~ 155°C; Tolerance: ±1%; Composition: Thick Film; Resistance (Ohms): 15k; Failure Rate: -; Height - Seated (Max): 0.016" (0.40mm); Packaging: Cut Tape (CT); Supplier Device Package: 0402; Size / Dimension: 0.039" L x 0.020" W (1.00mm x 0.50mm); Package / Case: 0402 (1005 Metric); Part Status: Active; Supplier 1: Digi-Key; Supplier Part Number 1: 311-15.0KLRCT-ND
R426 R428 R437 R442 R444 R446 R451 R452 = Res_0402: Manufacturer Part Number 1: ERJ-2RKF4422X; Manufacturer: Panasonic Electronic Components; Part Description: RES SMD 44.2K OHM 1% 1/10W 0402; Power (Watts): 0.1W, 1/10W; Temperature Coefficient: ±100ppm/°C; Value: 44.2k, 1%; Supplier 1: Digi-Key; Supplier Part Number 1: P44.2KLCT-ND; Tolerance: ±1%; Supplier Device Package: 0402; Packaging: Cut Tape (CT); Size / Dimension: 0.039" L x 0.020" W (1.00mm x 0.50mm); Features: Automotive AEC-Q200; Package / Case: 0402 (1005 Metric); Height: 0.016" (0.40mm); Operating Temperature: -55°C ~ 155°C; Number of Terminations: 2; Composition: Thick Film; Resistance (Ohms): 44.2k; RoHS: RoHS Compliant; Category: Resistors
R427 = Res_0402: Manufacturer: Yageo; Part Description: RES SMD 8.2K OHM 1% 1/16W 0402; Manufacturer Part Number 1: RC0402FR-078K2L; Power (Watts): 0.063W, 1/16W; Temperature Coefficient: ±100ppm/°C; Value: 8.2k, 1%; Supplier 1: Digi-Key; Supplier Device Package: 0402; Package / Case: 0402 (1005 Metric); Height: 0.016" (0.40mm); Supplier Part Number 1: 311-8.20KLRCT-ND; Number of Terminations: 2; Operating Temperature: -55°C ~ 155°C; Resistance (Ohms): 8.2k; Size / Dimension: 0.039" L x 0.020" W (1.00mm x 0.50mm); Composition: Thick Film; Category: Resistors; Tolerance: ±1%; Features: Moisture Resistant; RoHS: RoHS Compliant; Packaging: Cut Tape (CT)
R429 R439 R447 R448 = Res_0402: Manufacturer: Panasonic Electronic Components; Part Description: RES SMD 100K OHM 5% 1/10W 0402; Manufacturer Part Number 1: ERJ-2GEJ104X; Power (Watts): 0.1W, 1/10W; Temperature Coefficient: ±200ppm/°C; Value: 100k, 5%; Supplier 1: Digi-Key; Supplier Part Number 1: P100KJTR-ND; Category: Resistors; Size / Dimension: 0.039" L x 0.020" W (1.00mm x 0.50mm); Supplier Device Package: 0402; Composition: Thick Film; Number of Terminations: 2; RoHS: RoHS Compliant; Height: 0.016" (0.40mm); Operating Temperature: -55°C ~ 155°C; Features: Automotive AEC-Q200; Tolerance: ±5%; Packaging: Tape & Reel (TR); Resistance (Ohms): 100k; Package / Case: 0402 (1005 Metric)
R430 = Res_0402: Manufacturer: Panasonic Electronic Components; Manufacturer Part Number 1: ERJ-2RKF1243X; Part Description: RES SMD 124K OHM 1% 1/10W 0402; Power (Watts): 0.1W, 1/10W; Temperature Coefficient: ±100ppm/°C; Value: 124k, 1%; Supplier 1: Digi-Key; Supplier Part Number 1: P124KLCT-ND; Category: Resistors; Package / Case: 0402 (1005 Metric); Operating Temperature: -55°C ~ 155°C; Tolerance: ±1%; Packaging: Cut Tape (CT); Resistance (Ohms): 124k; Features: Automotive AEC-Q200; Height: 0.016" (0.40mm); Number of Terminations: 2; Supplier Device Package: 0402; Size / Dimension: 0.039" L x 0.020" W (1.00mm x 0.50mm); RoHS: RoHS Compliant; Composition: Thick Film
R431 R432 R435 R443 = Res_0402: Manufacturer: Yageo; Manufacturer Part Number 1: RC0402FR-0710KL; Part Description: RES SMD 10K OHM 1% 1/16W 0402; Temperature Coefficient: ±100ppm/°C; Power (Watts): 0.063W, 1/16W; Value: 10k, 1%; Supplier 1: Digi-Key; Supplier Part Number 1: 311-10.0KLRTR-ND; Resistance (Ohms): 10k; Packaging: Tape & Reel (TR); RoHS: RoHS Compliant; Package / Case: 0402 (1005 Metric); Tolerance: ±1%; Operating Temperature: -55°C ~ 155°C; Size / Dimension: 0.039" L x 0.020" W (1.00mm x 0.50mm); Number of Terminations: 2; Category: Resistors; Height: 0.016" (0.40mm); Supplier Device Package: 0402; Features: Moisture Resistant; Composition: Thick Film
R433 = Res_0402: Manufacturer: Vishay Dale; Manufacturer Part Number 1: CRCW040239K0FKED; Part Description: RES SMD 39K OHM 1% 1/16W 0402; Power (Watts): 0.063W, 1/16W; Temperature Coefficient: ±100ppm/°C; Value: 39k, 1%; Packaging: Cut Tape (CT); Tolerance: ±1%; Operating Temperature: -55°C ~ 155°C; RoHS: RoHS Compliant; Supplier Part Number 1: 541-39.0KLCT-ND; Features: Automotive AEC-Q200; Category: Resistors; Supplier Device Package 1: 0402 (1005 Metric); Supplier 1: Digi-Key; Composition: Thick Film; Package / Case: 0402 (1005 Metric); Size / Dimension: 0.039" L x 0.020" W (1.00mm x 0.50mm); Resistance (Ohms): 39k; Height: 0.016" (0.40mm); Number of Terminations: 2
R434 = Res_0402: Manufacturer Part Number 1: ERJ-2RKF6652X; Manufacturer: Panasonic Electronic Components; Part Description: RES SMD 66.5K OHM 1% 1/10W 0402; Temperature Coefficient: ±100ppm/°C; Power (Watts): 0.1W, 1/10W; Tolerance: ±1%; Value: 66.5k; Supplier 1: Digi-Key; Supplier Part Number 1: P66.5KLDKR-ND; Packaging: Digi-Reel®; Operating Temperature: -55°C ~ 155°C; Height: 0.016" (0.40mm); Size / Dimension: 0.039" L x 0.020" W (1.00mm x 0.50mm); Number of Terminations: 2; Package / Case: 0402 (1005 Metric); Resistance (Ohms): 66.5k; Category: Resistors; Supplier Device Package: 0402; Features: Automotive AEC-Q200; Composition: Thick Film; RoHS: RoHS Compliant
R436 = Res_0402: Manufacturer Part Number: ERJ-2RKF4752X; Manufacturer: Panasonic Electronic Components; Part Description: RES SMD 47.5K OHM 1% 1/10W 0402; Temperature Coefficient: ±100ppm/°C; Power (Watts): 0.1W, 1/10W; Value: 47.5k, 1%; Height: 0.016" (0.40mm); Supplier 1: Digi-Key; Features: Automotive AEC-Q200; Packaging: Cut Tape (CT); Composition: Thick Film; Number of Terminations: 2; Supplier Device Package: 0402; Category: Resistors; Package / Case: 0402 (1005 Metric); Supplier Part Number 1: P47.5KLCT-ND; Size / Dimension: 0.039" L x 0.020" W (1.00mm x 0.50mm); Resistance (Ohms): 47.5k; Operating Temperature: -55°C ~ 155°C; Tolerance: ±1%; RoHS: RoHS Compliant
R445 = Res_0402: Manufacturer: Yageo; Part Description: RES SMD 22K OHM 1% 1/16W 0402; Manufacturer Part Number 1: RC0402FR-0722KL; Temperature Coefficient: ±100ppm/°C; Power (Watts): 0.063W, 1/16W; Value: 22k, 1%; Number of Terminations: 2; Operating Temperature: -55°C ~ 155°C; Package / Case: 0402 (1005 Metric); Category: Resistors; Size / Dimension: 0.039" L x 0.020" W (1.00mm x 0.50mm); Height: 0.016" (0.40mm); Supplier 1: Digi-Key; Supplier Part Number 1: 311-22.0KLRCT-ND; RoHS: RoHS Compliant; Features: Moisture Resistant; Packaging: Cut Tape (CT); Composition: Thick Film; Supplier Device Package: 0402; Resistance (Ohms): 22k; Tolerance: ±1%
R449 = Res_0402: Manufacturer: Stackpole Electronics Inc.; Manufacturer Part Number 1: RMCF0402FT2K21; Part Description: RES SMD 2.21K OHM 1% 1/16W 0402; Power (Watts): 0.063W, 1/16W; Temperature Coefficient: ±100ppm/°C; Value: 2.21k, 1%; Supplier 1: Digi-Key; Supplier Part Number 1: RMCF0402FT2K21CT-ND; Operating Temperature: -55°C ~ 155°C; Height: 0.016" (0.40mm); Tolerance: ±1%; Resistance (Ohms): 2.21k; Features: Automotive AEC-Q200; Package / Case: 0402 (1005 Metric); Packaging: Cut Tape (CT); Composition: Thick Film; Category: Resistors; Supplier Device Package: 0402; Number of Terminations: 2; RoHS: RoHS Compliant; Size / Dimension: 0.039" L x 0.020" W (1.00mm x 0.50mm)
R450 = Res_0402: Manufacturer: Vishay Dale; Part Description: RES SMD 3K OHM 1% 1/16W 0402; Manufacturer Part Number 1: CRCW04023K00FKED; Temperature Coefficient: ±100ppm/°C; Power (Watts): 0.063W, 1/16W; Value: 3k, 1%; Category: Resistors; Tolerance: ±1%; RoHS: RoHS Compliant; Composition: Thick Film; Number of Terminations: 2; Operating Temperature: -55°C ~ 155°C; Supplier Device Package: 0402 (1005 Metric); Supplier Part Number 1: 541-3.00KLCT-ND; Packaging: Cut Tape (CT); Supplier 1: Digi-Key; Package / Case: 0402 (1005 Metric); Features: Automotive AEC-Q200; Resistance (Ohms): 3k; Height: 0.016" (0.40mm); Size / Dimension: 0.039" L x 0.020" W (1.00mm x 0.50mm)
R453 = Res_0402: Manufacturer: Panasonic Electronic Components; Manufacturer Part Number 1: ERA-2AED471X; Part Description: RES SMD 470 OHM 0.5% 1/16W 0402; Power (Watts): 0.063W, 1/16W; Temperature Coefficient: ±25ppm/°C; Resistance (Ohms): 470; Value: 470R, 0.5%; Supplier 1: Digi-Key; Supplier Part Number 1: P470DETR-ND; Tolerance: ±0.5%; Packaging: Tape & Reel (TR); Number of Terminations: 2; Operating Temperature: -55°C ~ 155°C; RoHS: RoHS Compliant; Size / Dimension: 0.039" L x 0.020" W (1.00mm x 0.50mm); Composition: Thin Film; Package / Case: 0402 (1005 Metric); Height: 0.016" (0.40mm); Features: Automotive AEC-Q200; Supplier Device Package: 0402; Category: Resistors
SW3 = SW_THD_SPDT_On-On_v2: Switch THD vertical toggle SPDT; Manufacturer: C&K Components; Part Description: Slide Switch SPDT Through Hole; Manufacturer Part Number 1: 1101M2S3CQE2; Voltage Rating - AC: 120V; Actuator Length: 5.08mm; Current Rating: 6A (AC/DC); Electrical Life: 40,000 Cycles; Switch Travel: 2.16mm; Voltage Rating - DC: 28V; Supplier 1: Digi-Key; Termination Style: PC Pin; Operating Temperature: -30°C ~ 65°C; Category: Switches; Switch Function: On-On; Supplier Part Number 1: CKN5001-ND
VD1 = MMBD1205: Part Description: Diode Array 1 Pair Common Anode Standard 100V 200mA Surface Mount TO-236-3, SC-59, SOT-23-3; Manufacturer: Fairchild Semiconductor; Reverse Recovery Time (trr): 4ns; Diode Configuration: 1 Pair Common Anode; Voltage - DC Reverse (Vr) (Max): 100V; Current - Average Rectified (Io) (per Diode): 200mA; Current - Reverse Leakage @ Vr: 50nA @ 50V; Voltage - Forward (Vf) (Max) @ If: 1V @ 200mA; Supplier 1: Digi-Key; Category: Discrete Semiconductor Products; Supplier Device Package: SOT-23-3 (TO-236); Package / Case: TO-236-3, SC-59, SOT-23-3; Supplier Part Number 1: MMBD1205CT-ND; Manufacturer Part Number 1: MMBD1205
VT19 VT20 = BSC093N04LS_G: Manufacturer: Infineon Technologies; Part Description: MOSFET N-CH 40V 49A TDSON-8; Power - Max: 35W; Vgs(th) (Max) @ Id: 2V @ 14µA; Current - Continuous Drain (Id) @ 25°C: 13A (Ta), 49A (Tc); FET Type: MOSFET N-Channel, Metal Oxide; Rds On (Max) @ Id, Vgs: 9.3 mOhm @ 40A, 10V; Gate Charge (Qg) @ Vgs: 24nC @ 10V; Input Capacitance (Ciss) @ Vds: 1900pF @ 20V; Drain to Source Voltage (Vdss): 40V; Supplier 1: Digi-Key; Category: Discrete Semiconductor Products; Package / Case: 8-PowerTDFN; Supplier Part Number 1: BSC093N04LS GDKR-ND; Manufacturer Part Number 1: BSC093N04LS G